# EAGLE design WaterMonitorV2 (EAGLE 7.4.0)
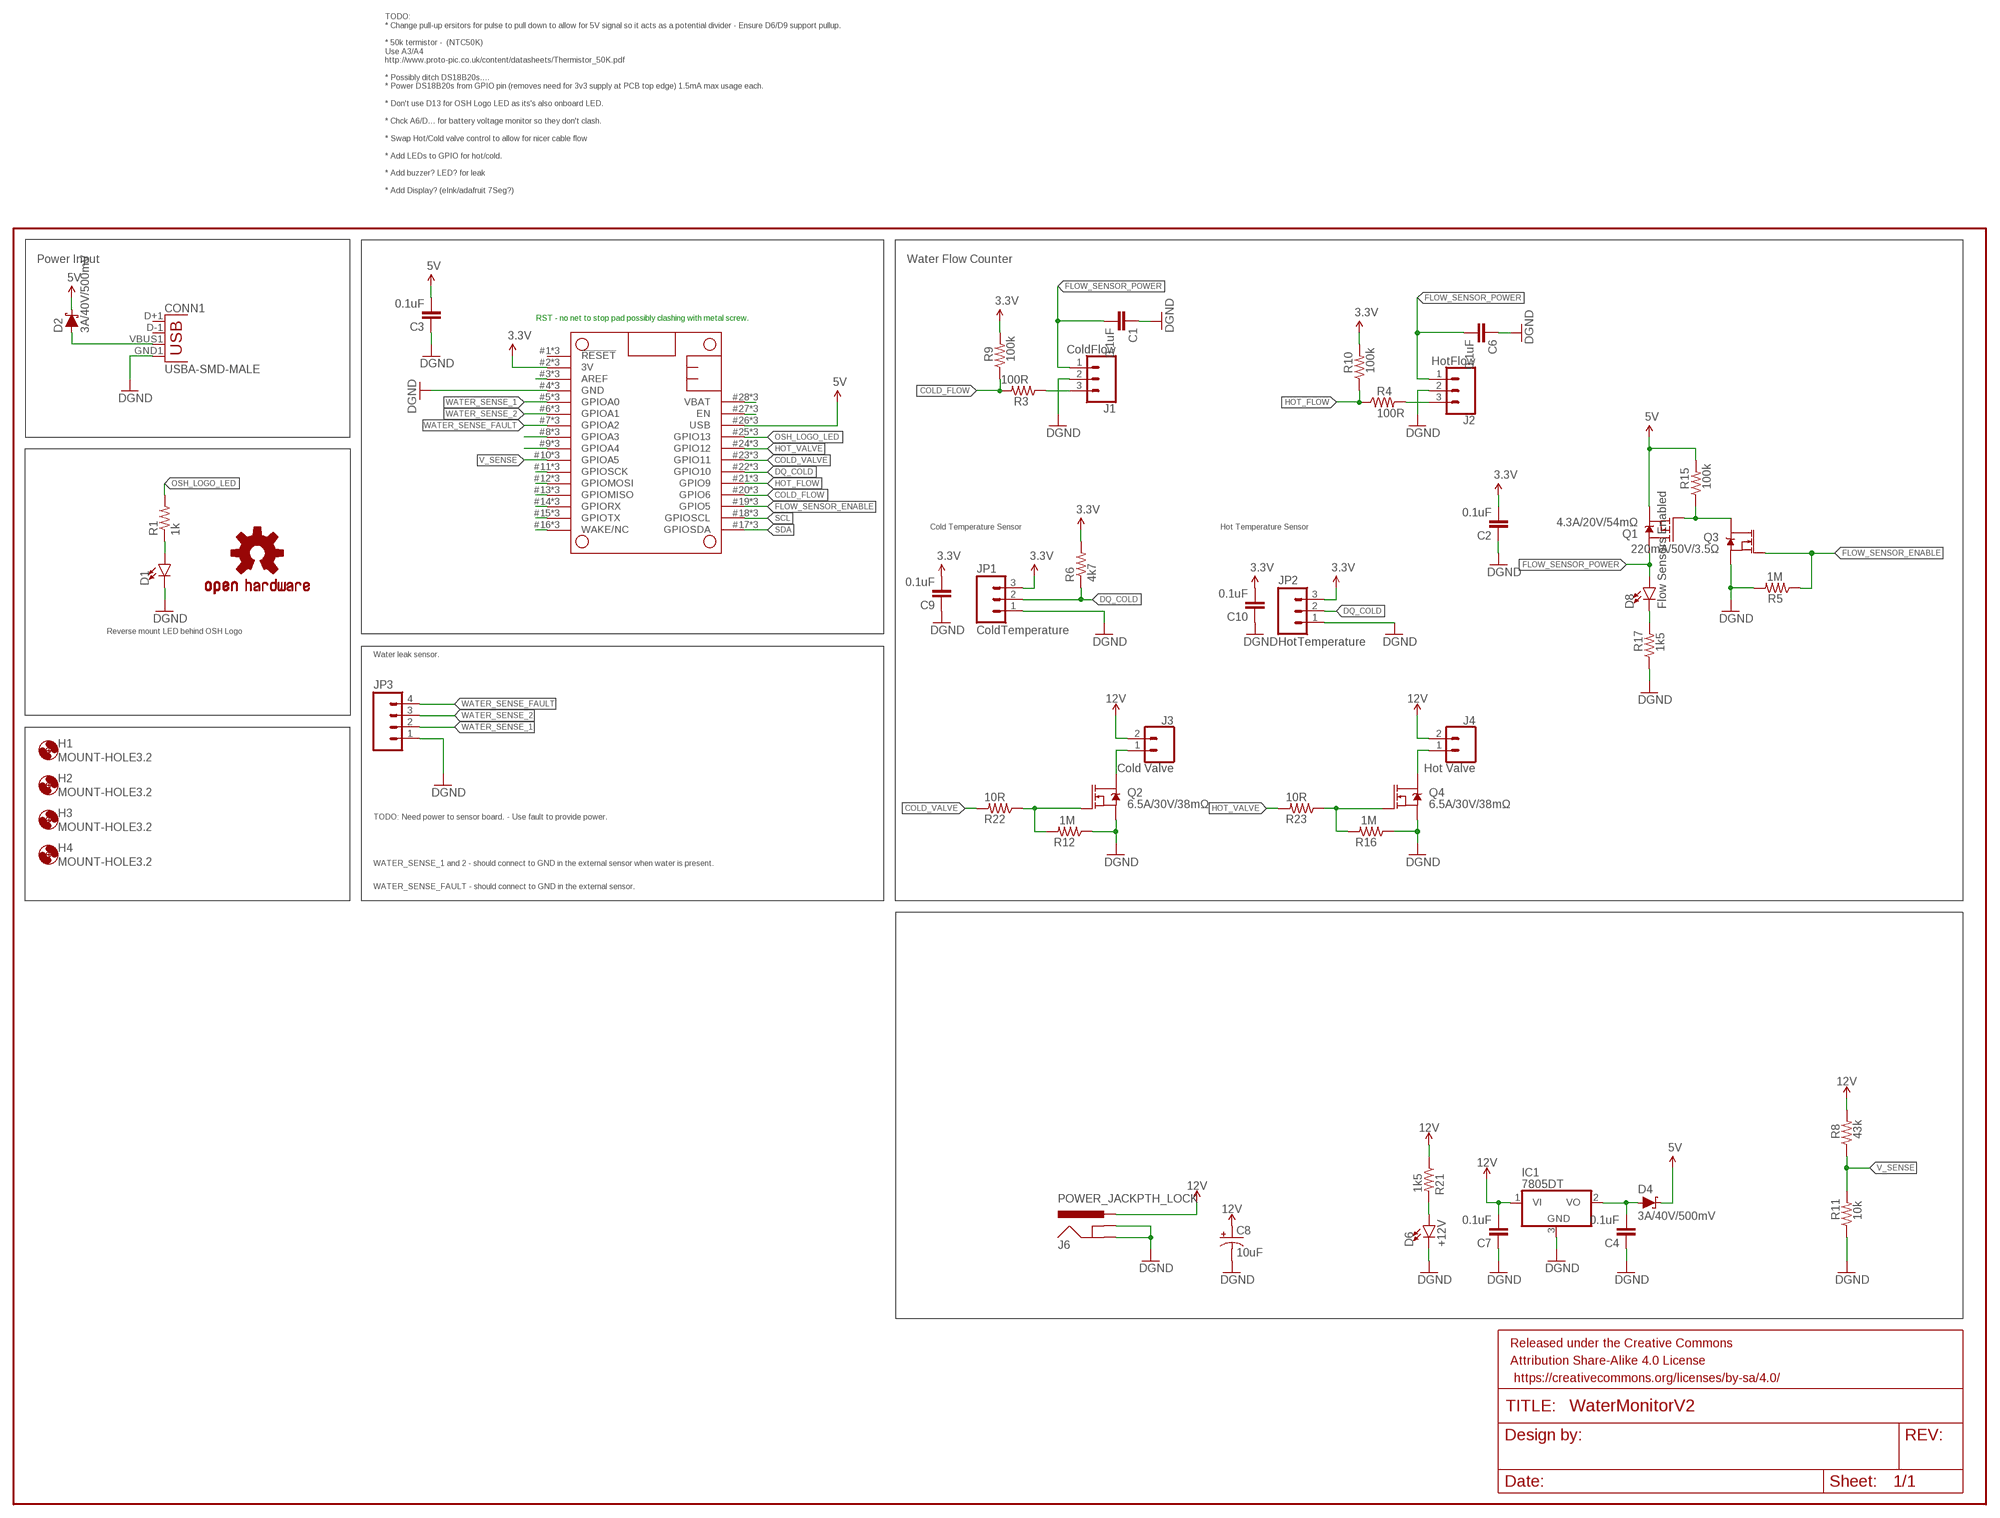
[diagram p0: schematic, sheet 1]

## Parts
C1  0.1uF  CAP0805  [0805]
C2  0.1uF  CAP0805  [0805]
C3  0.1uF  CAP0805  [0805]
C4  0.1uF  CAP0805  [0805]
C6  0.1uF  CAP0805  [0805]
C7  0.1uF  CAP0805  [0805]
C8  10uF  10UF-POLAR-EIA3216-16V-10%(TANT)  [EIA3216]
C9  0.1uF  CAP0805  [0805]
C10  0.1uF  CAP0805  [0805]
CONN1  USBA-SMD-MALE  [USB-A-SMT-MALE]
D1  LED1206-BOTTOM  [LED-1206-BOTTOM]
D2  3A/40V/500mV  DIODE-SCHOTTKY-B340A  [SMA-DIODE]
D4  3A/40V/500mV  DIODE-SCHOTTKY-B340A  [SMA-DIODE]
D6  +12V  LED-BLUE1206  [LED-1206]
D8  Flow Sensors Enabled  LED-BLUE1206  [LED-1206]
FRAME2  FRAME-LEDGER  [CREATIVE_COMMONS]
H1  MOUNT-HOLE3.2  [3,2]
H2  MOUNT-HOLE3.2  [3,2]
H3  MOUNT-HOLE3.2  [3,2]
H4  MOUNT-HOLE3.2  [3,2]
IC1  7805DT  [TO252]
J1  ColdFlow  CONN_03JST-HX-PTH-VERT  [JST-HX-3-PTH-VERT]
J2  HotFlow  CONN_03JST-HX-PTH-VERT  [JST-HX-3-PTH-VERT]
J3  Cold Valve  CONN_025MM  [SCREWTERMINAL-5MM-2]
J4  Hot Valve  CONN_025MM  [SCREWTERMINAL-5MM-2]
J6  POWER_JACKPTH_LOCK  [POWER_JACK_PTH_LOCK]
JP1  ColdTemperature  M03POLAR  [MOLEX-1X3]
JP2  HotTemperature  M03POLAR  [MOLEX-1X3]
JP3  M04POLAR  [MOLEX-1X4]
LOGO1  OSHW-LOGOM  [OSHW-LOGO-M]
MS1  FEATHERWINGFEATHEWING_BREAKOUT  [FEATHERWING_BREAKOUT]
Q1  4.3A/20V/54mΩ  MOSFET_PCH-IRLML2244  [SOT23-3]
Q2  6.5A/30V/38mΩ  MOSFET-NCH-FDS6630A  [SO08]
Q3  220mA/50V/3.5Ω  MOSFET-NCH-BSS138  [SOT23-3]
Q4  6.5A/30V/38mΩ  MOSFET-NCH-FDS6630A  [SO08]
R1  1k  RESISTOR1206  [1206]
R3  100R  RESISTOR0805-RES  [0805]
R4  100R  RESISTOR0805-RES  [0805]
R5  1M  RESISTOR0805-RES  [0805]
R6  4k7  RESISTOR0805-RES  [0805]
R8  43k  RESISTOR0805-RES  [0805]
R9  100k  RESISTOR0805-RES  [0805]
R10  100k  RESISTOR0805-RES  [0805]
R11  10k  RESISTOR0805-RES  [0805]
R12  1M  RESISTOR0805-RES  [0805]
R15  100k  RESISTOR0805-RES  [0805]
R16  1M  RESISTOR0805-RES  [0805]
R17  1k5  RESISTOR0805-RES  [0805]
R21  1k5  RESISTOR0805-RES  [0805]
R22  10R  RESISTOR0805-RES  [0805]
R23  10R  RESISTOR0805-RES  [0805]

## Nets
3.3V: C2.2 C9.2 C10.2 JP1.3 JP2.3 MS1.2(3V) MS1.#2(3V) MS1.@2(3V) R6.2 R9.2 R10.2
5V: C3.2 D2.C D4.C MS1.26(USB) MS1.#26(USB) MS1.@26(USB) Q1.2(S) R15.2
12V: C7.2 C8.+ IC1.1(VI) J3.2 J4.2 J6.PWR R8.2 R21.1
COLD_FLOW: MS1.20(GPIO6) MS1.#20(GPIO6) MS1.@20(GPIO6) R3.2 R9.1
COLD_VALVE: MS1.23(GPIO11) MS1.#23(GPIO11) MS1.@23(GPIO11) R22.2
DQ_COLD: JP1.2 JP2.2 MS1.22(GPIO10) MS1.#22(GPIO10) MS1.@22(GPIO10) R6.1
FLOW_SENSOR_ENABLE: MS1.19(GPIO5) MS1.#19(GPIO5) MS1.@19(GPIO5) Q3.1(G) R5.1
FLOW_SENSOR_POWER: C1.2 C6.2 D8.A J1.1 J2.1 Q1.3(D)
GND: C1.1 C2.1 C3.1 C4.1 C6.1 C7.1 C8.- C9.1 C10.1 CONN1.GND1(GND) D1.C D6.C IC1.3(GND) J1.2 J2.2 J6.GND J6.GNDBREAK JP1.1 JP2.1 JP3.1 MS1.4(GND) MS1.#4(GND) MS1.@4(GND) Q2.1(S) Q2.2(S) Q2.3(S) Q3.2(S) Q4.1(S) Q4.2(S) Q4.3(S) R5.2 R11.1 R12.1 R16.1 R17.1 ; supply symbol labelled DGND
HOT_FLOW: MS1.21(GPIO9) MS1.#21(GPIO9) MS1.@21(GPIO9) R4.1 R10.1
HOT_VALVE: MS1.24(GPIO12) MS1.#24(GPIO12) MS1.@24(GPIO12) R23.2
N$1: CONN1.VBUS1(VBUS) D2.A
N$3: J1.3 R3.1
N$4: J2.3 R4.2
N$7: D8.C R17.2
N$11: MS1.8(GPIOA3) MS1.#8(GPIOA3) MS1.@8(GPIOA3)
N$12: D6.A R21.2
N$15: MS1.27(EN) MS1.#27(EN) MS1.@27(EN)
N$16: MS1.9(GPIOA4) MS1.#9(GPIOA4) MS1.@9(GPIOA4)
N$19: Q1.1(G) Q3.3(D) R15.1
N$20: MS1.3(AREF) MS1.#3(AREF) MS1.@3(AREF)
N$21: D1.A R1.1
N$23: Q2.4(G) R12.2 R22.1
N$24: Q4.4(G) R16.2 R23.1
N$40: J3.1 Q2.5(D) Q2.6(D) Q2.7(D) Q2.8(D)
N$41: J4.1 Q4.5(D) Q4.6(D) Q4.7(D) Q4.8(D)
N$42: MS1.11(GPIOSCK) MS1.#11(GPIOSCK) MS1.@11(GPIOSCK)
N$43: MS1.12(GPIOMOSI) MS1.#12(GPIOMOSI) MS1.@12(GPIOMOSI)
N$44: MS1.13(GPIOMISO) MS1.#13(GPIOMISO) MS1.@13(GPIOMISO)
N$45: MS1.14(GPIORX) MS1.#14(GPIORX) MS1.@14(GPIORX)
N$46: MS1.15(GPIOTX) MS1.#15(GPIOTX) MS1.@15(GPIOTX)
N$47: MS1.16(WAKE/NC) MS1.#16(WAKE/NC) MS1.@16(WAKE/NC)
N$49: C4.2 D4.A IC1.2(VO)
OSH_LOGO_LED: MS1.25(GPIO13) MS1.#25(GPIO13) MS1.@25(GPIO13) R1.2
SCL: MS1.18(GPIOSCL) MS1.#18(GPIOSCL) MS1.@!8(GPIOSCL)
SDA: MS1.17(GPIOSDA) MS1.#17(GPIOSDA) MS1.@17(GPIOSDA)
V_SENSE: MS1.10(GPIOA5) MS1.#10(GPIOA5) MS1.@10(GPIOA5) R8.1 R11.2
VBAT: MS1.28(VBAT) MS1.#28(VBAT) MS1.@28(VBAT)
WATER_SENSE_1: JP3.2 MS1.5(GPIOA0) MS1.#5(GPIOA0) MS1.@5(GPIOA0)
WATER_SENSE_2: JP3.3 MS1.6(GPIOA1) MS1.#6(GPIOA1) MS1.@6(GPIOA1)
WATER_SENSE_FAULT: JP3.4 MS1.7(GPIOA2) MS1.#7(GPIOA2) MS1.@7(GPIOA2)
Unconnected: CONN1.D+1(D+) CONN1.D-1(D-) MS1.1(!RESET) MS1.#1(!RESET) MS1.@1(!RESET)

## Notes on the sheet
- TODO: 
  * Change pull-up ersitors for pulse to pull down to allow for 5V signal so it acts as a potential divider - Ensure D6/D9 support pullup.
  
  * 50k termistor -  (NTC50K)
  Use A3/A4
  http://www.proto-pic.co.uk/content/datasheets/Thermistor_50K.pdf
  
  * Possibly ditch DS18B20s....
  * Power DS18B20s from GPIO pin (removes need for 3v3 supply at PCB top edge) 1.5mA max usage each.
  
  * Don't use D13 for OSH Logo LED as its's also onboard LED.
  
  * Chck A6/D... for battery voltage monitor so they don't clash.
  
  * Swap Hot/Cold valve control to allow for nicer cable flow
  
  * Add LEDs to GPIO for hot/cold.
  
  * Add buzzer? LED? for leak
  
  * Add Display? (eInk/adafruit 7Seg?)
- Power Input | Water Flow Counter
- RST - no net to stop pad possibly clashing with metal screw.
- Cold Temperature Sensor | Hot Temperature Sensor
- Reverse mount LED behind OSH Logo
- Water leak sensor.
- TODO: Need power to sensor board. - Use fault to provide power.
- WATER_SENSE_1 and 2 - should connect to GND in the external sensor when water is present.
- WATER_SENSE_FAULT - should connect to GND in the external sensor.

## Library data of the parts
C1-C4 C6 C7 C9 C10 = SparkFun-Passives:CAP: Capacitor Standard 0603 ceramic capacitor, and 0.1" leaded capacitor.
C8 = SparkFun-Capacitors:10UF-POLAR: 10.0µF polarized capacitors A capacitor is a passive two-terminal electrical component used to store electrical energy temporarily in an electric field.; PROD_ID: CAP-00811
CONN1 = SparkFun-Connectors:USB: USB Connectors USB-B-PTH is fully proven SKU : PRT-00139/CONN-08278 USB-miniB is fully proven SKU : PRT-00587 USB-A-PCB is untested. USB-A-H is throughly reviewed, but untested. Spark Fun Electronics SKU : PRT-00437 USB-B-SMT is throughly reviewed, but untested. Needs silkscreen touching up. USB-A-S has not been used/tested USB-MB-H has not been used/tested USB-MICROB has been used. CONN-09505
D1 = SparkFun-LED:LED: LED (Generic) Standard schematic elements and footprints for 5mm, 3mm, 1206, and 0603 sized LEDs. Generic LEDs with no color specified.
D2 D4 = SparkFun-DiscreteSemi:DIODE-SCHOTTKY: Schottky diode A Schottky diode is a semiconductor diode which has a low forward voltage drop and a very fast switching action.; PROD_ID: DIO-09886
D6 D8 = SparkFun-LED:LED-BLUE: Blue SMD LED Used in manufacturing of various products at SparkFun Packages: 0603 - SMD 0603 package [Product Link] <http://www.digikey.com/product-detail/en/SMLE12BC7TT86/511-1589-2-ND/1641808> 1206 - SMD1206 package [Product Link] <http://www.digikey.com/product-detail/en/lite-on-inc/LTST-C150TBKT/160-1643-1-ND/573584> SparkFun Products: ESP8266 Thing-Dev Board <https://www.sparkfun.com/products/13711> RedBoard <https://www.sparkfun.com/products/12757>; PROD_ID: DIO-09911; VALUE: BLUE
FRAME2 = SparkFun-Aesthetics:FRAME-LEDGER: Schematic Frame Standard 11x14 US Ledger frame
H1-H4 = holes:MOUNT-HOLE: MOUNTING HOLE with drill center marker
IC1 = linear:78*: Positive VOLTAGE REGULATOR Source: http://cache.national.com/ds/LM/LM78L05.pdf http://www.fairchildsemi.com/ds/LM/LM7805.pdf
J1 J2 = Tinamous:CONN_03: Multi connection point. Often used as Generic Header-pin footprint for 0.1 inch spaced/style header connections On any of the 0.1 inch spaced packages, you can populate with these: Break Away Headers - Straight <https://www.sparkfun.com/products/116> (PRT-00116) Break Away Male Headers - Right Angle <https://www.sparkfun.com/products/553> (PRT-00553) Female Headers <https://www.sparkfun.com/products/115> (PRT-00115) Break Away Headers - Machine Pin <https://www.sparkfun.com/products/117> (PRT-00117) Break Away Female Headers - Swiss Machine Pin <https://www.sparkfun.com/products/743> (PRT-00743) Stackable Header - 3 Pin (Female, 0.1") <https://www.sparkfun.com/products/13875> (PRT-13875) For SCREWTERMINALS and SPRING TERMINALS visit here: Screw Terimnals on SparkFun.com <https://www.sparkfun.com/search/results?term=Screw+Terminals> (5mm/3.5mm/2.54mm spacing) This device is also useful as a general connection point to wire up your design to another part of your project. Our various solder wires solder well into these plated through hole pads. Hook-Up Wire - Assortment (Stranded, 22 AWG) <https://www.sparkfun.com/products/11375> (PRT-11375) Hook-Up Wire - Assortment (Solid Core, 22 AWG) <https://www.sparkfun.com/products/11367> (PRT-11367) View the entire wire category on our website here <https://www.sparkfun.com/categories/141> Special notes: Molex polarized connector foot print use with SKU : PRT-08232 with associated crimp pins and housings.
J3 J4 = SparkFun-Connectors:CONN_02: Multi connection point. Often used as Generic Header-pin footprint for 0.1 inch spaced/style header connections On any of the 0.1 inch spaced packages, you can populate with these: Break Away Headers - Straight <https://www.sparkfun.com/products/116> (PRT-00116) Break Away Male Headers - Right Angle <https://www.sparkfun.com/products/553> (PRT-00553) Female Headers <https://www.sparkfun.com/products/115> (PRT-00115) Break Away Headers - Machine Pin <https://www.sparkfun.com/products/117> (PRT-00117) Break Away Female Headers - Swiss Machine Pin <https://www.sparkfun.com/products/743> (PRT-00743) For SCREWTERMINALS and SPRING TERMINALS visit here: Screw Terimnals on SparkFun.com <https://www.sparkfun.com/search/results?term=Screw+Terminals> (5mm/3.5mm/2.54mm spacing) This device is also useful as a general connection point to wire up your design to another part of your project. Our various solder wires solder well into these plated through hole pads. Hook-Up Wire - Assortment (Stranded, 22 AWG) <https://www.sparkfun.com/products/11375> (PRT-11375) Hook-Up Wire - Assortment (Solid Core, 22 AWG) <https://www.sparkfun.com/products/11367> (PRT-11367) View the entire wire category on our website here <https://www.sparkfun.com/categories/141> Special notes: Molex polarized connector foot print use with: PRT-08233 with associated crimp pins and housings. 2.54_SCREWTERM for use with PRT-10571. 3.5mm Screw Terminal footprints for PRT-08084 5mm Screw Terminal footprints for use with PRT-08432; SF_SKU: PRT-08432
J6 = SparkFun-Connectors:POWER_JACK: Power Jack Connector This is the standard 5.5mm barrel jack for power. The PTH is the most common, proven, reliable, footprint. The Slot footprint only works if the mill layer is transmitted to the PCB fab house so be warned. Here are the connectors we sell at SparkFun: DC Barrel Power Jack/Connector <https://www.sparkfun.com/products/119> (PRT-00119) DC Barrel Power Jack/Connector (SMD) <https://www.sparkfun.com/products/12748> (PRT-12748) DC Barrel Jack Adapter - Breadboard Compatible <https://www.sparkfun.com/products/10811> (PRT-10811) It is used on this SparkFun product (and many, many others): SparkFun RedBoard - Programmed with Arduino <https://www.sparkfun.com/products/12757> (DEV-12757) Also, if you need a mating power supply or connector, please check these out: Wall Adapter Power Supply - 9VDC 650mA <https://www.sparkfun.com/products/298> (TOL-00298) DC Barrel Jack Adapter - Male <https://www.sparkfun.com/products/10287> (PRT-10287); PROD_ID: CONN-08197; SF_ID: PRT-00119
JP1 JP2 = SparkFun-Connectors:M03: Header 3 Standard 3-pin 0.1" header. Use with straight break away headers (SKU : PRT-00116), right angle break away headers (PRT-00553), swiss pins (PRT-00743), machine pins (PRT-00117), and female headers (PRT-00115). Molex polarized connector foot print use with SKU : PRT-08232 with associated crimp pins and housings.
JP3 = SparkFun-Connectors:M04: Header 4 Standard 4-pin 0.1" header. Use with straight break away headers (SKU : PRT-00116), right angle break away headers (PRT-00553), swiss pins (PRT-00743), machine pins (PRT-00117), and female headers (PRT-00115). Molex polarized connector foot print use with SKU : PRT-08231 with associated crimp pins and housings. 1MM SMD Version SKU: PRT-10208
LOGO1 = SparkFun-Aesthetics:OSHW-LOGO: Open Source Hardware Logo This logo indicates the piece of hardware it is found on incorporates a OSHW license and/or adheres to the definition of open source hardware found here: http://freedomdefined.org/OSHW
MS1 = ThingySticks:FEATHERWING
Q1 = SparkFun-DiscreteSemi:MOSFET_PCH: P-channel MOSFETs Voltage controlled devices that allow control of high current outputs. SparkFun Products: SparkFun ESP32 Thing <https://www.sparkfun.com/products/13907> SparkFun ESP8266 Thing <https://www.sparkfun.com/products/13231>; PROD_ID: TRANS-11153
Q2 Q4 = SparkFun-DiscreteSemi:MOSFET-NCH: N-channel MOSFETs Voltage controlled devices that allow control of high current outputs. SparkFun Products: SparkFun OpenScale <https://www.sparkfun.com/products/13261> SparkFun Digital Sandbox <https://www.sparkfun.com/products/12651> SparkFun Monster Moto Shield <https://www.sparkfun.com/products/10182> SparkFun MOSFET Power Controller <https://www.sparkfun.com/products/11214>; PROD_ID: TRANS-08089
Q3 = SparkFun-DiscreteSemi:MOSFET-NCH: N-channel MOSFETs Voltage controlled devices that allow control of high current outputs. SparkFun Products: SparkFun OpenScale <https://www.sparkfun.com/products/13261> SparkFun Digital Sandbox <https://www.sparkfun.com/products/12651> SparkFun Monster Moto Shield <https://www.sparkfun.com/products/10182> SparkFun MOSFET Power Controller <https://www.sparkfun.com/products/11214>; PROD_ID: TRANS-00830
R1 R3-R6 R8-R12 R15-R17 R21-R23 = SparkFun-Resistors:RESISTOR: Resistor Basic schematic elements and footprints for 0603, 1206, and PTH resistors.

## Board
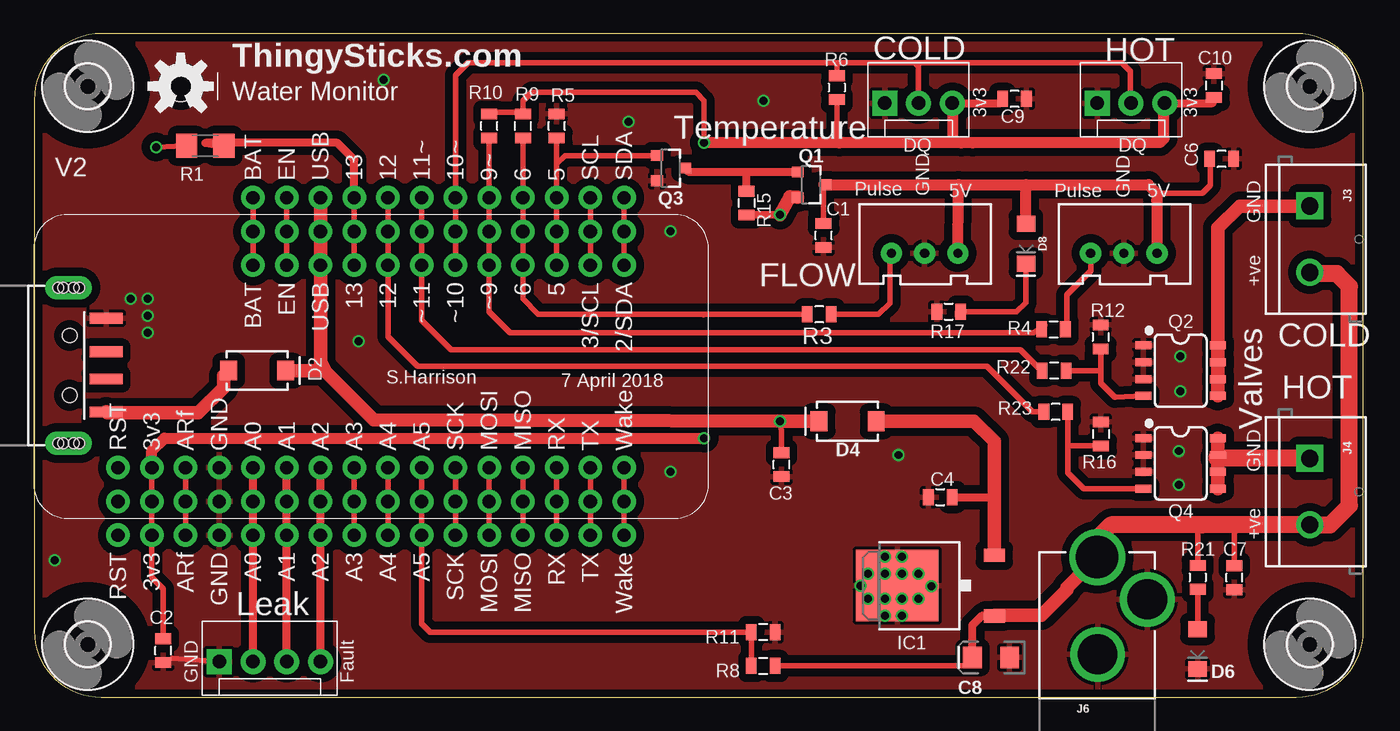
[diagram p1: board, top side]
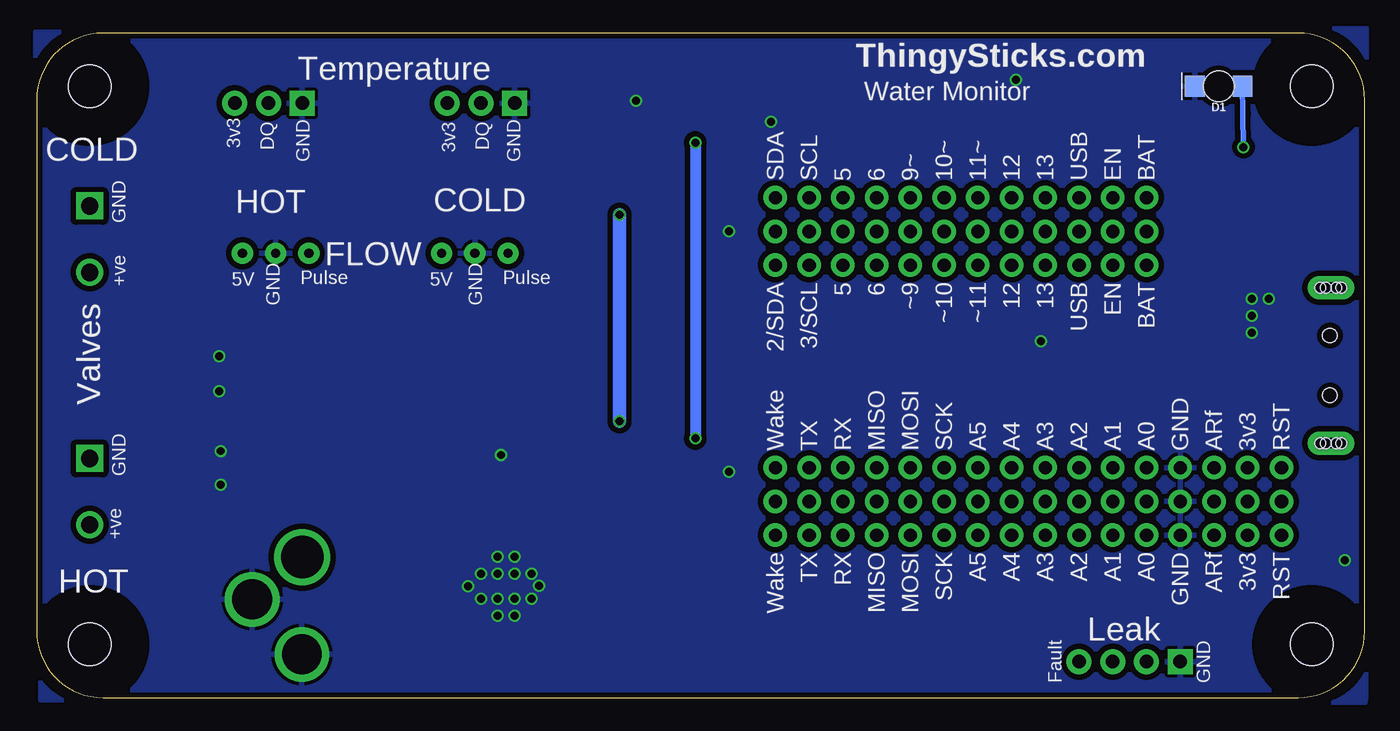
[diagram p2: board, bottom side, seen from below]

Size 100 x 50 mm. Coordinates in mm from the lower left corner, seen from the top.
Outline: 5,50 95,50 arc-90 100,45 100,5 arc-90 95,0 5,0 arc-90 0,5 0,45 arc-90 5,50
Copper layers (1*16): Top 0.035mm / dielectric 1.5mm / Bottom 0.035mm
Design rules "dirt_cheap_dirty_boards.v1": minimum track width 5mil, minimum drill 12mil, track to track 5mil, track to pad 5mil, pad to pad 5mil, via to via 5mil, smd to smd 0mil, copper to edge 10mil, drill to drill 10mil, minimum pad ring 10mil, minimum via ring 6mil, stop-mask expansion 2mil, vias tented up to drill 25mil, thermal gap 10mil

### Footprints (pad centres in the part's own frame; a part is rotated, then mirrored left to right if it is on the bottom)
0805 = smd 0.8 x 1.2: 1 -0.9,0; 2 0.9,0
EIA3216 = smd 1.4 x 1.6: + 1.4,0; - -1.4,0
USB-A-SMT-MALE = smd 0.8 x 2.5: D+1 1.027,-5.87; D-1 -1.027,-5.87; GND1 3.551,-5.87; VBUS1 -3.5,-5.87 | drill 0.8 pad 1.778 long: P$1 5.85,-3.05; P$3 -5.85,-3.05 | hole 1.1: 2.25,-3.12; -2.25,-3.12 | hole 0.8: -5.85,-3.45; -5.85,-3.85; -5.85,-2.65; -5.85,-2.25; 5.85,-3.45; 5.85,-3.85; 5.85,-2.65; 5.85,-2.25
LED-1206-BOTTOM = smd 1.5 x 1.6: A -1.8,0; C 1.8,0 | hole 2.3: 0,0
SMA-DIODE = smd 1.27 x 1.47: A -2.15,0; C 2.15,0
LED-1206 = smd 1.2 x 1.4: A -1.5,0; C 1.5,0
3,2 = hole 3.2: 0,0
TO252 = smd 1 x 1.6: 1 -2.28,-4.8; 2 2.28,-4.8 | smd 5.4 x 6.2: 3 0,2.5
JST-HX-3-PTH-VERT = drill 0.7 pad 1.6: 1 7.5,2.35; 2 5,2.35; 3 2.5,2.35
SCREWTERMINAL-5MM-2 = drill 1.3 pad 2.032 square: 1 0,0 | drill 1.3 pad 2.032: 2 5,0
POWER_JACK_PTH_LOCK = drill 2.997 pad 4.115: GND 0.025,6.557; GNDBREAK 3.762,10.7 | drill 3.2 pad 4.115: PWR 0,13.878
MOLEX-1X3 = drill 1.016 pad 1.88 square: 1 0,0 | drill 1.016 pad 1.88: 2 2.54,0; 3 5.08,0
MOLEX-1X4 = drill 1.016 pad 1.88 square: 1 0,0 | drill 1.016 pad 1.88: 2 2.54,0; 3 5.08,0; 4 7.62,0
FEATHERWING_BREAKOUT = drill 1 pad 1.778: 1 6.35,1.27; 2 8.89,1.27; 3 11.43,1.27; 4 13.97,1.27; 5 16.51,1.27; 6 19.05,1.27; 7 21.59,1.27; 8 24.13,1.27; 9 26.67,1.27; 10 29.21,1.27; 11 31.75,1.27; 12 34.29,1.27; 13 36.83,1.27; 14 39.37,1.27; 15 41.91,1.27; 16 44.45,1.27; 17 44.45,21.59; 18 41.91,21.59; 19 39.37,21.59; 20 36.83,21.59; 21 34.29,21.59; 22 31.75,21.59; 23 29.21,21.59; 24 26.67,21.59; 25 24.13,21.59; 26 21.59,21.59; 27 19.05,21.59; 28 16.51,21.59; #1 6.35,3.81; #2 8.89,3.81; #3 11.43,3.81; #4 13.97,3.81; #5 16.51,3.81; #6 19.05,3.81; #7 21.59,3.81; #8 24.13,3.81; #9 26.67,3.81; #10 29.21,3.81; #11 31.75,3.81; #12 34.29,3.81; #13 36.83,3.81; #14 39.37,3.81; #15 41.91,3.81; #16 44.45,3.81; #17 44.45,19.05; #18 41.91,19.05; #19 39.37,19.05; #20 36.83,19.05; #21 34.29,19.05; #22 31.75,19.05; #23 29.21,19.05; #24 26.67,19.05; #25 24.13,19.05; #26 21.59,19.05; #27 19.05,19.05; #28 16.51,19.05; @1 6.35,-1.27; @2 8.89,-1.27; @3 11.43,-1.27; @4 13.97,-1.27; @5 16.51,-1.27; @6 19.05,-1.27; @7 21.59,-1.27; @8 24.13,-1.27; @9 26.67,-1.27; @10 29.21,-1.27; @11 31.75,-1.27; @12 34.29,-1.27; @13 36.83,-1.27; @14 39.37,-1.27; @15 41.91,-1.27; @16 44.45,-1.27; @17 44.45,24.13; @19 39.37,24.13; @20 36.83,24.13; @21 34.29,24.13; @22 31.75,24.13; @23 29.21,24.13; @24 26.67,24.13; @25 24.13,24.13; @26 21.59,24.13; @27 19.05,24.13; @28 16.51,24.13; @!8 41.91,24.13
SOT23-3 = smd 0.8 x 0.9: 1 -0.95,-1; 2 0.95,-1; 3 0,1.1
SO08 = smd 0.6 x 1.2: 1 -1.905,-2.8; 2 -0.635,-2.8; 3 0.635,-2.8; 4 1.905,-2.8; 5 1.905,2.8; 6 0.635,2.8; 7 -0.635,2.8; 8 -1.905,2.8
1206 = smd 1.6 x 1.8: 1 -1.4,0; 2 1.4,0

### Placement (x,y rotation side)
C1  59.39,34.78 90 top
C2  9.67,3.53 90 top
C3  56.22,17.52 90 top
C4  68.19,15.08 0 top
C6  89.36,40.55 180 top
C7  90.31,9.02 90 top
C8  72,3.01 180 top
C9  73.76,45.05 180 top
C10  88.78,46.05 270 top
CONN1  -0.5,25 90 top
D1  11,46 180 bottom
D2  16.75,24.61 0 top
D4  61.2,20.8 180 top
D6  87.55,3.65 270 top
D8  74.64,34.15 270 top
FRAME2  16.75,-12.23 0 top  (outside the outline)
H1  4,46 0 top
H2  96,4 0 top
H3  96,46 0 top
H4  4,4 0 top
IC1  67.44,8.43 90 top
J1  62,31.09 0 top
J2  77,31.09 0 top
J3  96,37 270 top
J4  96,18 270 top
J6  80,-3.31 0 top
JP1  64,44.73 0 top
JP2  80,44.73 0 top
JP3  13.89,2.7 0 top
LOGO1  11,46 0 top
MS1  -0.08,13.49 0 top
Q1  58.44,38.59 270 top
Q2  86.28,24.61 270 top
Q3  47.87,39.84 270 top
Q4  86.28,17.62 270 top
R1  12.83,41.53 0 top
R3  59.07,28.84 180 top
R4  76.7,27.71 0 top
R5  39.29,43.02 90 top
R6  60.39,45.9 270 top
R8  54.85,2.38 0 top
R9  36.75,43.02 90 top
R10  34.21,43.02 90 top
R11  54.85,4.92 180 top
R12  80.25,27.14 270 top
R15  53.6,37.2 270 top
R16  80.28,19.84 270 top
R17  68.82,29.05 0 top
R21  87.55,9.05 270 top
R22  76.76,24.61 180 top
R23  76.88,21.5 180 top

### Tracks (layer width: path | path; a pad name or v marks a point on that pad's centre or on a via)
3.3V  (via drill 0.6)
  Top 0.406: MS1.#2 MS1.2 MS1.@2 8.81,9.05 9.67,8.19 C2.2 | R6.2 60.39,41.93 60.56,41.75 | v50.41,41.75 50.41,44.92 49.77,45.56 37.39,45.56 36.75,44.92 R9.2 36.66,44.05 34.35,44.05 R10.2
  Top 0.61: JP1.3 72.71,44.73 C9.2 | JP2.3 88.68,44.73 C10.2
  Top 0.813: MS1.#2 8.81,18.57 9.77,19.52 v50.41,19.52 | 68.92,41.77 arc4 71.46,41.77 84.72,41.77 85.01,42.07 85.01,44.66 JP2.3 | 68.92,41.77 60.56,41.75 v50.41,41.75 | JP1.3 69.08,41.93 68.92,41.77
  Bottom 0.813: v50.41,41.75 v50.41,19.52
5V  (via drill 0.6)
  Top 0.406: C3.2 56.22,20.06 v56.12,20.8
  Top 0.61: v56.12,36.35 R15.2
  Top 1.016: MS1.@26 MS1.26 MS1.#26 21.51,25.24 21.83,24.61 | 21.83,24.61 25.53,20.91 D4.C v56.12,20.8 | D2.C 21.83,24.61 | v56.12,36.35 56.86,37.69 Q1.2
  Bottom 1.016: v56.12,20.8 v56.12,36.35
12V
  Top 0.406: R21.1 87.55,12.68 87.87,13 | R8.2 69.96,2.38 C8.+ | C7.2 90.31,12.9 90.41,13
  Top 0.61: 72.29,6.19 IC1.1 72.2,6.19 71.36,6.19 70.59,5.42 C8.+
  Top 0.813: J6.PWR 79.36,10.57 | 72.31,6.08 IC1.1
  Top 1.016: 72.29,6.19 75.81,6.19 77.71,8.1 77.71,8.28 J6.PWR
  Top 1.27: J6.PWR 79.93,10.63 79.93,11.9 81.03,13 87.87,13 90.41,13 J4.2 97.54,13 98.98,14.45 98.98,30.95 98.03,31.91 96.09,31.91 J3.2
COLD_FLOW
  Top 0.406: R3.2 49.14,28.84 | 49.14,28.84 37.91,28.84 36.75,30 MS1.#20 MS1.20 MS1.@20 R9.1 36.75,42.26 | 50.36,28.8 49.14,28.84
COLD_VALVE
  Top 0.406: MS1.@23 MS1.23 MS1.#23 29.13,28.41 31.35,26.19 74.22,26.19 75.81,24.61 R22.2
DQ_COLD
  Top 0.406: MS1.#22 MS1.22 MS1.@22 31.67,46.83 32.62,47.78 60.56,47.78 | 60.56,47.78 66.28,47.78 | 66.28,47.78 81.84,47.78 82.47,47.15 82.47,46.07 JP2.2 | JP1.2 66.54,47.52 66.28,47.78 | R6.1 60.39,47.6 60.56,47.78
FLOW_SENSOR_ENABLE
  Top 0.406: MS1.#19 MS1.19 MS1.@19 | Q3.1 39.92,40.8 39.29,40.16 MS1.@19 | R5.1 MS1.@19
FLOW_SENSOR_POWER
  Top 0.406: C1.2 59.39,38.59 | 84.48,37.96 87.89,37.96 88.5,38.58 88.5,40.5 C6.2
  Top 0.813: J2.1 84.48,37.4 84.48,37.96 83.84,38.59 74.64,38.59 | 59.39,38.59 Q1.3 69.56,38.59 | 69.56,38.59 74.64,38.59 | J1.1 69.55,37.95 69.56,38.59 | D8.A 74.64,38.59
GND  (via drill 0.6)
  Top 0.406: C2.1 10.33,2.95 JP3.1
  other vias: 24.37,26.83 65.01,18.26 66.55,7.42 66.55,9.32 65.28,10.6 64,10.6 62.73,9.32 64,9.32 65.28,9.32 65.28,7.42 64,7.42 62.73,7.42 64,6.15 65.28,6.15 62.15,8.41 67.5,8.37 54.85,44.92 47.87,16.98 86.23,25.7 86.23,23.04 86.14,18.55 86.14,16.03 8.5,28.73 8.5,30 7.23,30 8.5,27.46 1.51,10.32 26.27,46.51 47.87,35.08 44.69,43.34
  pour Bottom (isolate 0.406, rank 6): -0.11,50.37 100.07,50.07 99.69,-0.18 -0.01,-0.4 -0.06,0
  pour Top (isolate 0.61, rank 6): -0.1,50.41 100.05,50.08 99.83,-0.13 0.01,-0.41
HOT_FLOW
  Top 0.406: R4.1 76.05,28.02 75.17,27.46 35.8,27.46 34.21,29.05 MS1.#21 MS1.21 MS1.@21 R10.1 34.21,42.23
HOT_VALVE
  Top 0.406: MS1.@24 MS1.24 MS1.#24 26.59,27.14 28.81,24.92 71.68,24.92 75.1,21.5 R23.2
N$1
  Top 1.016: CONN1.VBUS1 5.44,21.43 12.3,21.43 14.21,23.34 14.21,24.21 D2.A
N$3
  Top 0.406: R3.1 63.25,28.83 63.52,28.83 64.38,29.68 64.38,33.5 J1.3
N$4
  Top 0.406: J2.3 79.5,32.11 77.71,30.32 77.71,27.82 R4.2
N$7
  Top 0.406: D8.C 74.64,29.7 73.9,29.05 69.45,29.05 69.45,28.68 R17.2
N$11
  Top 0.406: MS1.#8 MS1.8 MS1.@8
N$12
  Top 0.406: R21.2 D6.A
N$15
  Top 0.406: MS1.#27 MS1.27 MS1.@27
N$16
  Top 0.406: MS1.@9 MS1.9 MS1.#9
N$19
  Top 0.61: Q1.1 53.58,39.55 | 53.58,39.55 49.27,39.55 Q3.3 | R15.1 53.6,39.52 53.58,39.55
N$20
  Top 0.406: MS1.#3 MS1.3 MS1.@3
N$21  (via drill 0.6)
  Top 0.406: R1.1 11.25,41.53 v9.13,41.43
  Bottom 0.406: v9.13,41.43 9.17,43.97 D1.A
N$23
  Top 0.406: Q2.4 81.32,22.59 80.25,23.65 80.25,24.61 | 80.25,24.61 R12.2 | R22.1 80.25,24.61
N$24
  Top 0.406: R23.1 77.78,18.89 | 77.78,18.89 77.78,16.92 78.98,15.71 Q4.4 | R16.2 77.83,18.94 77.78,18.89
N$40
  Top 1.016: Q2.5 Q2.6 Q2.7 Q2.8 89.08,35.34 90.73,36.99 95.99,36.99 J3.1
N$41
  Top 0.406: 96.23,18.23 J4.1
  Top 1.016: Q4.5 Q4.6 Q4.7 Q4.8
  Top 1.27: J4.1 89.03,18 Q4.7
N$42
  Top 0.406: MS1.@11 MS1.11 MS1.#11
N$43
  Top 0.406: MS1.#12 MS1.12 MS1.@12
N$44
  Top 0.406: MS1.@13 MS1.13 MS1.#13
N$45
  Top 0.406: MS1.#14 MS1.14 MS1.@14
N$46
  Top 0.406: MS1.@15 MS1.15 MS1.#15
N$47
  Top 0.406: MS1.#16 MS1.16 MS1.@16
N$49
  Top 0.61: C4.2 72.25,15.08
  Top 1.016: IC1.2 72.25,15.08 72.25,19.27 70.72,20.8 D4.A
OSH_LOGO_LED
  Top 0.406: MS1.@25 MS1.25 MS1.#25
  Top 0.61: MS1.@25 24.05,40.48 22.78,41.75 12.86,41.75 R1.2
SCL
  Top 0.406: MS1.@!8 MS1.18 MS1.#18
SDA
  Top 0.406: MS1.#17 MS1.17 MS1.@17
V_SENSE
  Top 0.406: R8.1 R11.2 54.16,4.97 53.58,4.92 29.77,4.92 29.13,5.55 MS1.@10 MS1.10 MS1.#10
VBAT
  Top 0.406: MS1.@28 MS1.28 MS1.#28
WATER_SENSE_1
  Top 0.61: JP3.2 MS1.@5 MS1.5 MS1.#5
WATER_SENSE_2
  Top 0.61: JP3.3 MS1.@6 MS1.6 MS1.#6
WATER_SENSE_FAULT
  Top 0.61: JP3.4 MS1.@7 MS1.7 MS1.#7

### Text on the board
tNames: COLD | HOT | ThingySticks.com | Water Monitor | Temperature | 3v3 | 3v3 | DQ | DQ | V2 | Pulse | GND | 5V | Pulse | GND | 5V | GND | FLOW | +ve | COLD | S.Harrison | 7 April 2018 | HOT | Valves | GND | +ve | Leak | GND | Fault
bNames: Temperature | ThingySticks.com | Water Monitor | GND | GND | 3v3 | DQ | 3v3 | DQ | COLD | COLD | HOT | GND | FLOW | Pulse | 5V | Pulse | 5V | +ve | GND | GND | Valves | GND | +ve | HOT | GND | Leak | Fault